# EAGLE design li-sht31 (EAGLE 7.6.0)
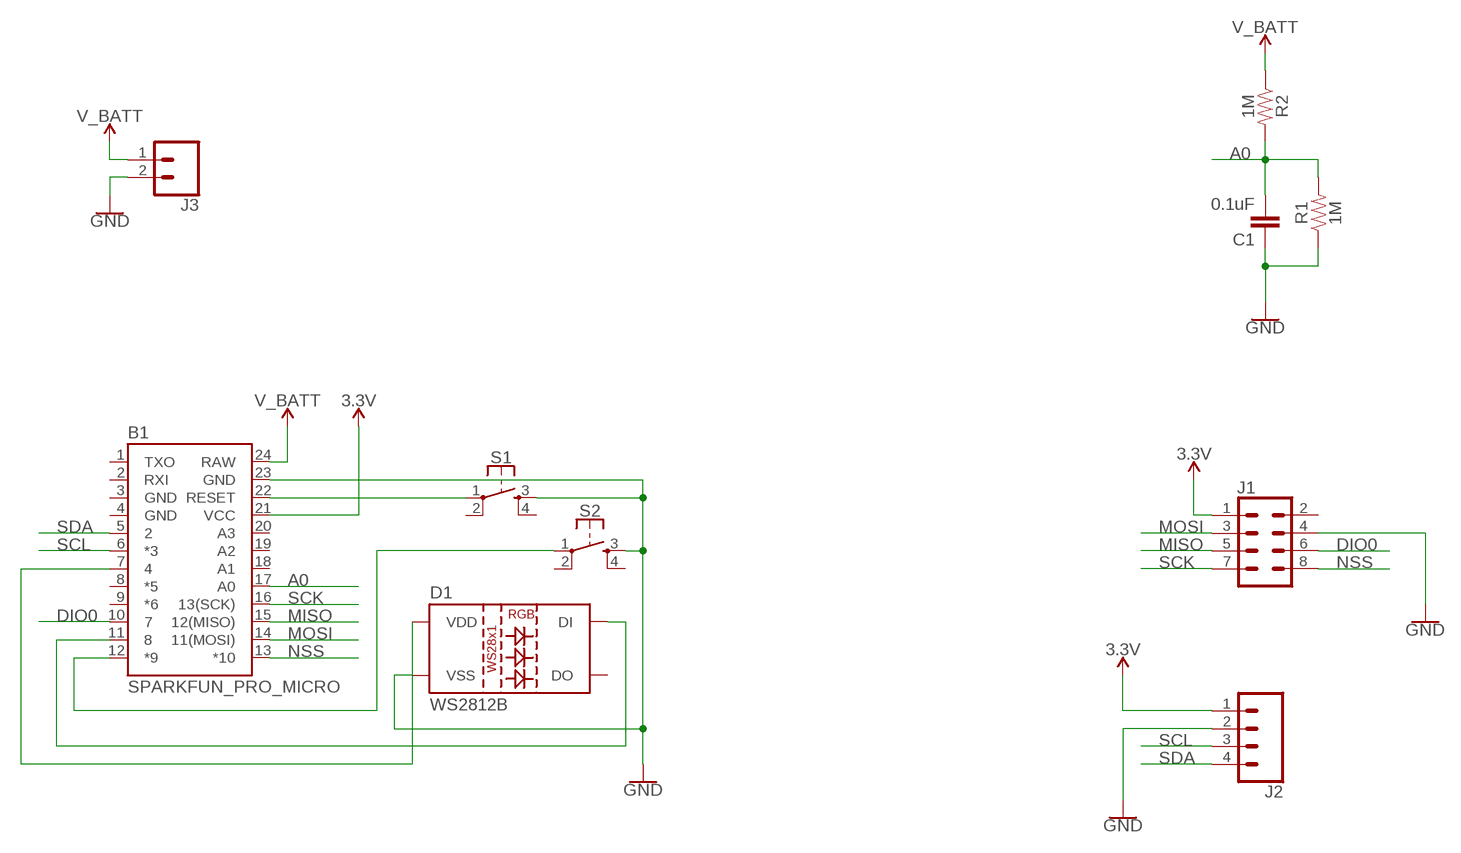
[diagram p0: schematic, sheet 1]

## Parts
B1  SPARKFUN_PRO_MICRO  [SPARKFUN_PRO_MICRO]
C1  0.1uF  0.1UF-0603-25V-(+80/-20%)  [0603]
D1  WS2812B  [WS2812B]
J1  CONN_04X2  [2X4]
J2  CONN_04  [1X04]
J3  CONN_02  [1X02]
R1  1M  1MOHM-0603-1/4W-5%  [0603]
R2  1M  1MOHM-0603-1/4W-5%  [0603]
S1  MOMENTARY-SWITCH-SPST-2-SMD-5.2MM  [TACTILE_SWITCH_SMD_5.2MM]
S2  MOMENTARY-SWITCH-SPST-2-SMD-5.2MM  [TACTILE_SWITCH_SMD_5.2MM]

## Nets
3.3V: B1.21(VCC) J1.1 J2.1
A0: B1.17(A0) C1.2 R1.2 R2.2
DIO0: B1.10 J1.6
MISO: B1.15(12(MISO)) J1.5
MOSI: B1.14(11(MOSI)) J1.3
N$5: B1.11 D1.4(DI)
N$6: B1.23(GND) C1.1 D1.3(VSS) J1.4 J2.2 J3.2 R1.1 S1.3 S2.3 ; supply symbol labelled GND
N$8: B1.7 D1.1(VDD)
N$10: B1.12(*9) S2.1
N$11: B1.22(RESET) S1.1
NSS: B1.13(*10) J1.8
SCK: B1.16(13(SCK)) J1.7
SCL: B1.6(*3) J2.3
SDA: B1.5 J2.4
V_BATT: B1.24(RAW) J3.1 R2.1
Unconnected: B1.1(TXO) B1.2(RXI) B1.8(*5) B1.9(*6) B1.18(A1) B1.19(A2) B1.20(A3) D1.2(DO) J1.2 S1.2 S1.4 S2.2 S2.4

## Power pins joined to a net without a drawn wire
N$6: B1.3(GND) B1.4(GND)

## Library data of the parts
B1 = SparkFun-Boards:SPARKFUN_PRO_MICRO: SparkFun Pro Micro Atmega32U4 compatible footprint. SparkFun Products: 3.3V/8MHz <https://www.sparkfun.com/products/12587> 5V/16MHz <https://www.sparkfun.com/products/12640>
C1 = SparkFun-Capacitors:0.1UF: 0.1µF ceramic capacitors A capacitor is a passive two-terminal electrical component used to store electrical energy temporarily in an electric field.; PROD_ID: CAP-00810
D1 = SparkFun-LED:WS2812B: WS2812B SMD addressable RGB LED 5x5mm SMD LED with built-in controller IC. Color: Red/Green/Blue mC Rating: RGB: 390, 660, 180 mcd Forward Voltage: RGB: 2.0, 3.0, 3.0 V Packages:WS2812B SparkFun Products: Blynk Board - ESP8266 <https://www.sparkfun.com/products/13794>; PROD_ID: DIO-12503
J1 = SparkFun-Connectors:CONN_04X2: Multi connection point. Often used as Generic Header-pin footprint for 0.1 inch spaced/style header connections On any of the 0.1 inch spaced packages, you can populate with these: Break Away Headers - Straight <https://www.sparkfun.com/products/116> (PRT-00116) Break Away Male Headers - Right Angle <https://www.sparkfun.com/products/553> (PRT-00553) Female Headers <https://www.sparkfun.com/products/115> (PRT-00115) Break Away Headers - Machine Pin <https://www.sparkfun.com/products/117> (PRT-00117) Break Away Female Headers - Swiss Machine Pin <https://www.sparkfun.com/products/743> (PRT-00743)
J2 = SparkFun-Connectors:CONN_04: Multi connection point. Often used as Generic Header-pin footprint for 0.1 inch spaced/style header connections On any of the 0.1 inch spaced packages, you can populate with these: Break Away Headers - Straight <https://www.sparkfun.com/products/116> (PRT-00116) Break Away Male Headers - Right Angle <https://www.sparkfun.com/products/553> (PRT-00553) Female Headers <https://www.sparkfun.com/products/115> (PRT-00115) Break Away Headers - Machine Pin <https://www.sparkfun.com/products/117> (PRT-00117) Break Away Female Headers - Swiss Machine Pin <https://www.sparkfun.com/products/743> (PRT-00743) For SCREWTERMINALS and SPRING TERMINALS visit here: Screw Terimnals on SparkFun.com <https://www.sparkfun.com/search/results?term=Screw+Terminals> (5mm/3.5mm/2.54mm spacing) This device is also useful as a general connection point to wire up your design to another part of your project. Our various solder wires solder well into these plated through hole pads. Hook-Up Wire - Assortment (Stranded, 22 AWG) <https://www.sparkfun.com/products/11375> (PRT-11375) Hook-Up Wire - Assortment (Solid Core, 22 AWG) <https://www.sparkfun.com/products/11367> (PRT-11367) View the entire wire category on our website here <https://www.sparkfun.com/categories/141> Special notes: Molex polarized connector foot print use with SKU : PRT-08231 with associated crimp pins and housings. 1MM SMD Version SKU: PRT-10208; PROD_ID: CONN-09696
J3 = SparkFun-Connectors:CONN_02: Multi connection point. Often used as Generic Header-pin footprint for 0.1 inch spaced/style header connections On any of the 0.1 inch spaced packages, you can populate with these: Break Away Headers - Straight <https://www.sparkfun.com/products/116> (PRT-00116) Break Away Male Headers - Right Angle <https://www.sparkfun.com/products/553> (PRT-00553) Female Headers <https://www.sparkfun.com/products/115> (PRT-00115) Break Away Headers - Machine Pin <https://www.sparkfun.com/products/117> (PRT-00117) Break Away Female Headers - Swiss Machine Pin <https://www.sparkfun.com/products/743> (PRT-00743) For SCREWTERMINALS and SPRING TERMINALS visit here: Screw Terimnals on SparkFun.com <https://www.sparkfun.com/search/results?term=Screw+Terminals> (5mm/3.5mm/2.54mm spacing) This device is also useful as a general connection point to wire up your design to another part of your project. Our various solder wires solder well into these plated through hole pads. Hook-Up Wire - Assortment (Stranded, 22 AWG) <https://www.sparkfun.com/products/11375> (PRT-11375) Hook-Up Wire - Assortment (Solid Core, 22 AWG) <https://www.sparkfun.com/products/11367> (PRT-11367) View the entire wire category on our website here <https://www.sparkfun.com/categories/141> Special notes: Molex polarized connector foot print use with: PRT-08233 with associated crimp pins and housings. 2.54_SCREWTERM for use with PRT-10571. 3.5mm Screw Terminal footprints for PRT-08084 5mm Screw Terminal footprints for use with PRT-08432
R1 R2 = SparkFun-Resistors:1MOHM: 1MΩ resistor A resistor is a passive two-terminal electrical component that implements electrical resistance as a circuit element. Resistors act to reduce current flow, and, at the same time, act to lower voltage levels within circuits. - Wikipedia; PROD_ID: RES-07868
S1 S2 = SparkFun-Switches:MOMENTARY-SWITCH-SPST-2: Momentary Switch (Pushbutton) - SPST - Two Circuits Normally-open (NO) SPST momentary switches (buttons, pushbuttons). Schematic symbol includes two switch circuits. Variants SMD-4.6MMX2.8MM - 4.60mm x 2.80mm Tactile Momentary Button Switch - Used on SparkFun SAMD21 Mini Breakout <https://www.sparkfun.com/products/13664> SMD-5.2MM - Mini Pushbutton Switch - SMD <https://www.sparkfun.com/products/8720> - Used on Arduino Pro Mini <https://www.sparkfun.com/products/11114>; PROD_ID: SWCH-08247; SF_SKU: COM-08720

## Board
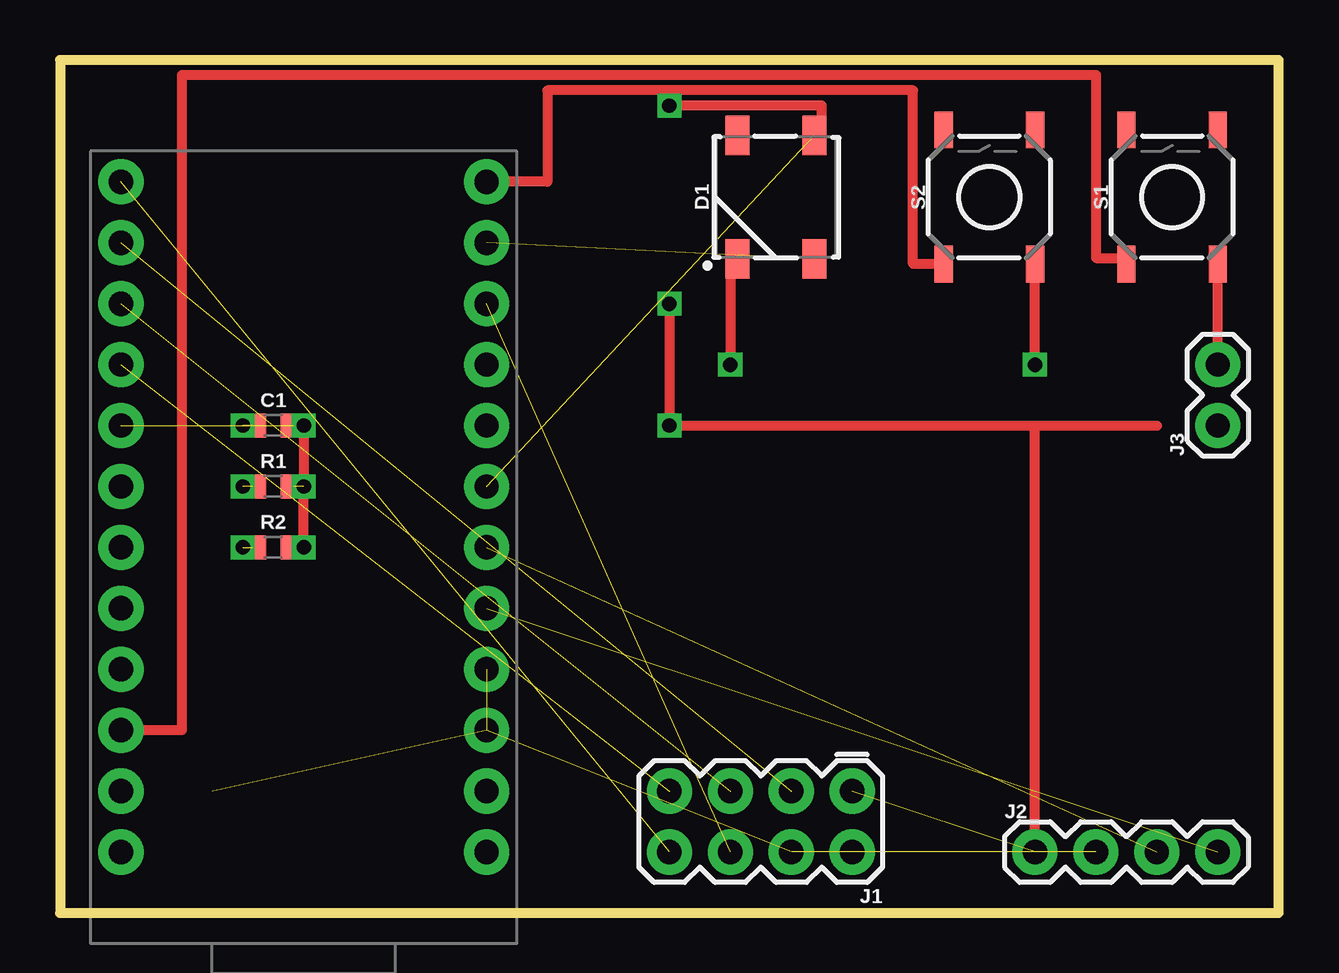
[diagram p1: board, top side]
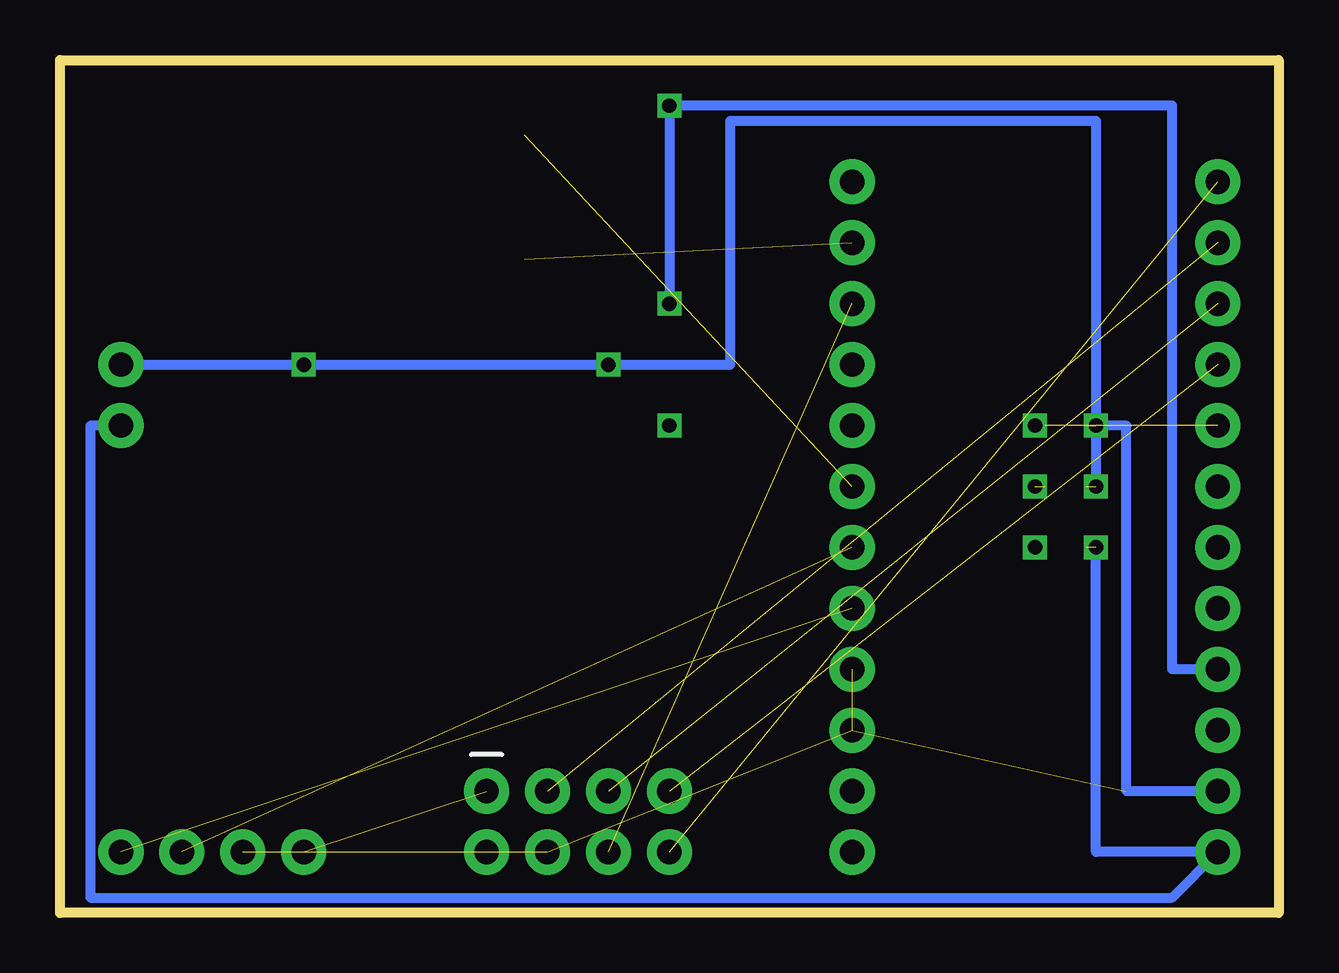
[diagram p2: board, bottom side, seen from below]

Size 50.8 x 35.56 mm. Coordinates in mm from the lower left corner, seen from the top.
Outline: 0,0 50.8,0 50.8,35.56 0,35.56 0,0
Copper layers (1*16): Top 0.035mm / dielectric 1.5mm / Bottom 0.035mm
Design rules "default": minimum track width 10mil, minimum drill 24mil, track to track 8mil, track to pad 8mil, pad to pad 8mil, via to via 8mil, smd to smd 8mil, copper to edge 40mil, drill to drill 8mil, minimum pad ring 10mil, minimum via ring 8mil, stop-mask expansion 4mil, vias tented up to drill 0mil, thermal gap 10mil

### Footprints (pad centres in the part's own frame; a part is rotated, then mirrored left to right if it is on the bottom)
SPARKFUN_PRO_MICRO = drill 1.016 pad 1.88: 1 -7.62,12.7; 2 -7.62,10.16; 3 -7.62,7.62; 4 -7.62,5.08; 5 -7.62,2.54; 6 -7.62,0; 7 -7.62,-2.54; 8 -7.62,-5.08; 9 -7.62,-7.62; 10 -7.62,-10.16; 11 -7.62,-12.7; 12 -7.62,-15.24; 13 7.62,-15.24; 14 7.62,-12.7; 15 7.62,-10.16; 16 7.62,-7.62; 17 7.62,-5.08; 18 7.62,-2.54; 19 7.62,0; 20 7.62,2.54; 21 7.62,5.08; 22 7.62,7.62; 23 7.62,10.16; 24 7.62,12.7
0603 = smd 1.1 x 1: 1 -0.85,0; 2 0.85,0
WS2812B = smd 1.651 x 1: 1 2.577,-1.6; 2 2.577,1.6; 3 -2.577,1.6; 4 -2.577,-1.6
2X4 = drill 1.016 pad 1.88: 1 -3.81,-1.27; 2 -3.81,1.27; 3 -1.27,-1.27; 4 -1.27,1.27; 5 1.27,-1.27; 6 1.27,1.27; 7 3.81,-1.27; 8 3.81,1.27
1X04 = drill 1.016 pad 1.88: 1 0,0; 2 2.54,0; 3 5.08,0; 4 7.62,0
1X02 = drill 1.016 pad 1.88: 1 0,0; 2 2.54,0
TACTILE_SWITCH_SMD_5.2MM = smd 1.524 x 0.762: 1 -2.794,1.905; 2 2.794,1.905; 3 -2.794,-1.905; 4 2.794,-1.905

### Placement (x,y rotation side)
B1  10.16,15.24 180 top
C1  8.89,20.32 0 top
D1  29.84,29.84 90 top
J1  29.21,3.81 180 top
J2  40.64,2.54 0 top
J3  48.26,20.32 90 top
R1  8.89,17.78 0 top
R2  8.89,15.24 0 top
S1  46.35,29.84 90 top
S2  38.73,29.84 90 top

### Tracks (layer width: path | path; a pad name or v marks a point on that pad's centre or on a via)
3.3V  (via drill 0.6)  (1 unrouted)
  Top 0.406: v25.4,25.4 25.4,20.32 40.64,20.32 | 40.64,20.32 45.72,20.32 | J2.1 40.64,20.32 | 31.75,32.42 31.75,33.66 v25.4,33.66
  Bottom 0.406: B1.21 4.45,10.16 4.45,33.66 v25.4,33.66 v25.4,25.4
A0  (2 unrouted)
  Top 0.406: R2.2 10.16,15.24 10.16,17.78 | 10.16,17.78 R1.2 | C1.2 10.16,20.32 10.16,17.78
DIO0  (1 unrouted)
MISO  (1 unrouted)
MOSI  (1 unrouted)
N$1  (via drill 0.6)
  other vias: 10.16,20.32
N$2  (via drill 0.6)
  other vias: 10.16,17.78
N$3  (via drill 0.6)
  other vias: 10.16,15.24
N$4  (via drill 0.6)
  other vias: 25.4,20.32
N$5  (1 unrouted)
N$6  (via drill 0.6)  (6 unrouted)
  Top 0.406: D1.3 27.94,27.27 v27.94,22.86 | J3.2 S1.3 | v40.64,22.86 S2.3
  Bottom 0.406: J3.2 v40.64,22.86 v27.94,22.86 22.86,22.86 22.86,33.02 7.62,33.02 v7.62,20.32 | v7.62,20.32 v7.62,17.78 | B1.23 6.35,5.08 6.35,20.32 v7.62,20.32
N$8  (1 unrouted)
N$10
  Top 0.406: S2.1 35.56,27.05 35.56,34.29 20.32,34.29 20.32,30.48 B1.12
N$11
  Top 0.406: B1.22 5.08,7.62 5.08,34.92 43.18,34.92 43.18,27.3 44.45,27.3 S1.1
NSS  (1 unrouted)
SCK  (1 unrouted)
SCL  (1 unrouted)
SDA  (1 unrouted)
V_BATT  (via drill 0.6)  (1 unrouted)
  Bottom 0.406: J3.1 49.53,20.32 49.53,0.64 4.45,0.64 B1.24 7.62,2.54 v7.62,15.24